# Altium schematic sheet Accumulator_Sandwich.SchDoc
size A4; SheetNumber: 1; SheetTotal: 1
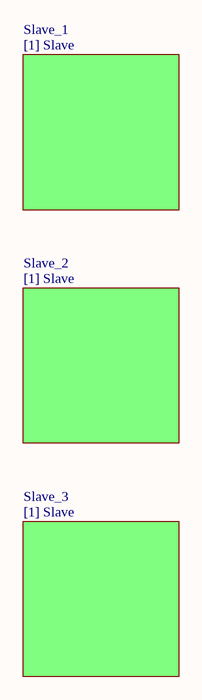
[diagram p0: Accumulator_Sandwich.SchDoc]

## Sub-sheets
Slave_1 = [1] Slave: no entries
Slave_2 = [1] Slave: no entries
Slave_3 = [1] Slave: no entries

## Notes on the sheet
- Title
- Size:
- Date:
- A4
- Number:
- Time:
- Revision:
- Sheet
- of
- File: